# Altium schematic sheet T-FC10W-M.SchDoc
size A4; PageSetup: Record=PageOptions|CenterHorizontal=True|CenterVertical=True|PrintScale=0.97|XCorrection=1.00|YCorrection=1.00|PrintKind=0|BorderSize=5000000|LeftOffset=0|BottomOffset=0|Orientation=2|PaperLength=1000|PaperWidth=1000|Scale=100|PaperSource=7|PrintQuality=-3|MediaType=1|DitherType=10|PrintScaleMode=1|PaperKind=A4|PaperIndex=9
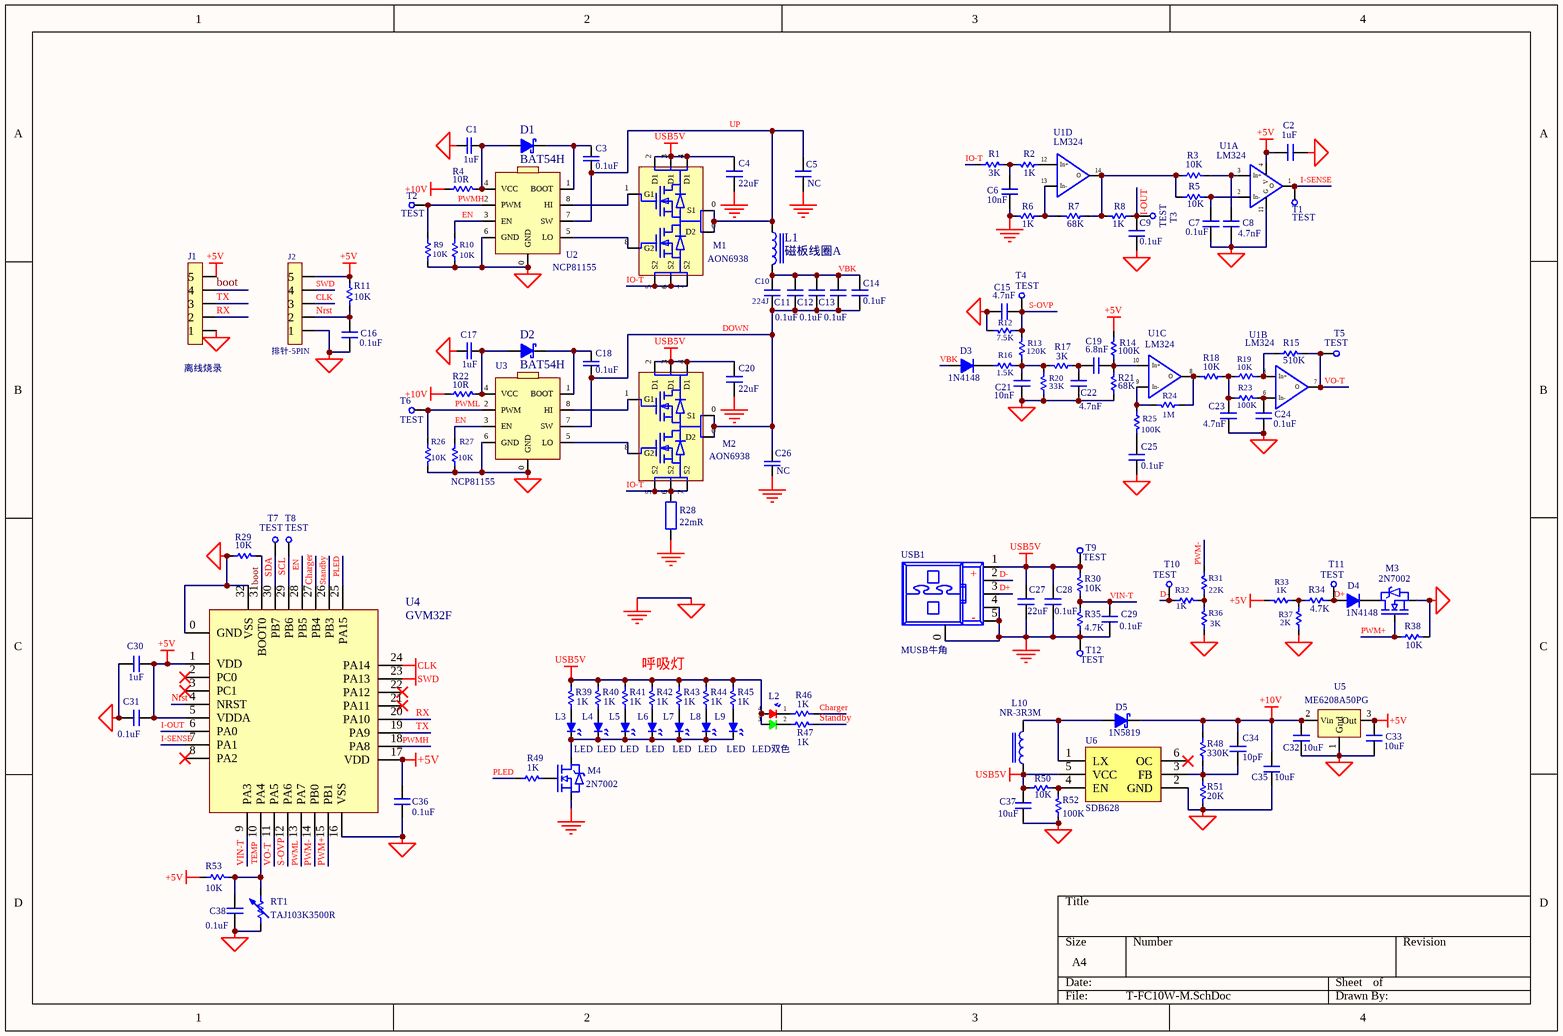
[diagram p0: T-FC10W-M.SchDoc]

## Parts
C1  0.1uF  [0603]  (value not drawn)
C2  1uF  [0603]
C3  0.1uF  [0603]
C4  22uF  [1206]
C5  NC  [0603]
C6  10nF  [0603]
C7  0.1uF  [0603]
C8  4.7nF  [0603]
C9  0.1uF  [0603]
C10  224J  [薄膜电容A]
C11  0.1uF  [1206]
C12  0.1uF  [1206]
C13  0.1uF  [1206]
C14  0.1uF  [1206]
C15  4.7nF  [0603]
C16  0.1uF  [0603]
C17  0.1uF  [0603]  (value not drawn)
C18  0.1uF  [0603]
C19  6.8nF  [0603]
C20  22uF  [1206]
C21  10nF  [0603]
C22  4.7nF  [0603]
C23  4.7nF  [0603]
C24  0.1uF  [0603]
C25  0.1uF  [0603]
C26  NC  [0603]
C27  22uF  [1206]
C28  0.1uF  [0603]
C29  0.1uF  [0603]
C30  1uF  [0603]
C31  0.1uF  [0603]
C32  10uF  [0805]
C33  10uF  [0805]
C34  10pF  [0603]
C35  10uF  [0805]
C36  0.1uF  [0603]
C37  10uF  [0805]
C38  0.1uF  [0603]
D1  BAT54H  [SOD-323]
D2  BAT54H  [SOD-323]
D3  1N4148  [SOD-323]
D4  1N4148  [SOD-323]
D5  1N5819  [SOD-123]
J1  离线烧录  [5PIN排针1.25mm]
J2  排针-5PIN  [5PIN排针1.25mm]
L1  磁板线圈A  [磁板线圈]
L2  LED双色  [LED0603双色]
L3  LED  [LED0802]
L4  LED  [LED0802]
L5  LED  [LED0802]
L6  LED  [LED0802]
L7  LED  [LED0802]
L8  LED  [LED0802]
L9  LED  [LED0802]
L10  NR-3R3M  [L3015T]
M1  AON6938  [QFN-5*6]
M2  AON6938  [QFN-5*6]
M3  2N7002  [SOT-23-L]
M4  2N7002  [SOT-23-L]
R1  3K  [0603]
R2  1K  [0603]
R3  10K  [0603]
R4  10R  [0603]
R5  10K  [0603]
R6  1K  [0603]
R7  68K  [0603]
R8  1K  [0603]
R9  10K  [0603]
R10  10K  [0603]
R11  10K  [0603]
R12  7.5K  [0603]
R13  120K  [0603]
R14  100K  [0603]
R15  510K  [0603]
R16  1.5K  [0603]
R17  3K  [0603]
R18  10K  [0603]
R19  10K  [0603]
R20  33K  [0603]
R21  68K  [0603]
R22  10R  [0603]
R23  100K  [0603]
R24  1M  [0603]
R25  100K  [0603]
R26  10K  [0603]
R27  10K  [0603]
R28  22mR  [1206]
R29  10K  [0603]
R30  10K  [0603]
R31  22K  [0603]
R32  1K  [0603]
R33  1K  [0603]
R34  4.7K  [0603]
R35  4.7K  [0603]
R36  3K  [0603]
R37  2K  [0603]
R38  10K  [0603]
R39  1K  [0603]
R40  1K  [0603]
R41  1K  [0603]
R42  1K  [0603]
R43  1K  [0603]
R44  1K  [0603]
R45  1K  [0603]
R46  1K  [0603]
R47  1K  [0603]
R48  330K  [0603]
R49  1K  [0603]
R50  10K  [0603]
R51  20K  [0603]
R52  100K  [0603]
R53  10K  [0603]
RT1  TAJ103K3500R  [0603]
T1  TEST  [测试点]
T2  TEST  [测试点]
T3  TEST  [测试点]
T4  TEST  [测试点]
T5  TEST  [测试点]
T6  TEST  [测试点]
T7  TEST  [测试点]
T8  TEST  [测试点]
T9  TEST  [测试点]
T10  TEST  [测试点]
T11  TEST  [测试点]
T12  TEST  [测试点]
U1  LM324  [SOP-14]  (parts A,B,C,D of 4)
U2  NCP81155  [QFN-3*3-1]
U3  NCP81155  [QFN-3*3-1]
U4  GVM32F  [QFN-32PIN]
U5  ME6208A50PG  [SOT-89]
U6  SDB628  [SOT-23-6]
USB1  MUSB牛角  [MICRO-USB牛角]

## Nets
+5V: C2.2 C30.1 C31.1 C33.2 C36.1 J1.5 J2.5 R11.1 R14.2 R33.2 R53.1 U1.4(V) U4.1(VDD) U4.5(VDDA) U4.17(VDD) U5.3(Out)
+10V: C32.2 C34.2 C35.2 D5.2(K) R4.1 R22.1 R48.2 U5.2(Vin)
CLK: J2.3 U4.24(PA14)
GND: C1.2 C2.1 C4.1 C5.1 C6.1 C7.1 C8.1 C9.2 C15.2 C16.1 C17.2 C20.1 C21.1 C22.1 C23.1 C24.1 C25.2 C26.1 C27.1 C28.1 C29.1 C30.2 C31.2 C32.1 C33.1 C35.1 C36.2 C37.1 C38.1 J1.1 J2.1 M3.3(S) M4.3(S) R6.2 R9.2 R10.1 R12.2 R20.1 R21.1 R26.2 R27.1 R28.1 R29.1 R35.1 R36.1 R37.1 R38.2 R51.2 R52.1 RT1.1 T12.1 U1.11(G) U2.0(GND) U2.6(GND) U3.0(GND) U3.6(GND) U4.0(GND) U4.16(VSS) U4.32(VSS) U5.1(Gnd) U6.2(GND) USB1.0 USB1.4 USB1.5
SWD: J2.4 U4.23(PA13)
USB5V: C4.2 C20.2 C27.2 C28.2 C37.2 L2.3(A) L2.4(A) L10.1 M1.2(D1) M1.3(D1) M1.4(D1) M2.2(D1) M2.3(D1) M2.4(D1) R30.2 R39.2 R40.2 R41.2 R42.2 R43.2 R44.2 R45.2 R50.1 T9.1 U6.5(VCC) USB1.1
boot: J1.4 R29.2 U4.31(BOOT0)
Charger: R46.2 U4.27(PB4)
D+: D4.1 R34.2 T11.1 USB1.3
D-: R32.1 T10.1 USB1.2
DOWN: C10.1 C11.1 C12.1 C13.1 C14.1 C18.1 C26.2 M2.0(D2) U3.7(SW)
EN: R10.2 R27.2 U2.3(EN) U3.3(EN) U4.28(PB5)
I-OUT: C9.1 R8.1 T3.1 U4.6(PA0)
I-SENSE: T1.1 U1.1(O) U4.7(PA1)
IO-T: M1.5(S2) M1.6(S2) M1.7(S2) M2.5(S2) M2.6(S2) M2.7(S2) R1.1 R28.2
Nrst: C16.2 J2.2 R11.2 U4.4(NRST)
PLED: R49.1 U4.25(PA15)
PWM+: M3.1(G) R38.1 U4.15(PB1)
PWM-: R31.2 U4.14(PB0)
PWMH: R9.1 T2.1 U2.2(PWM) U4.18(PA8)
PWML: R26.1 T6.1 U3.2(PWM) U4.13(PA7)
RX: J1.2 U4.20(PA10)
S-OVP: C15.1 R12.1 R13.2 T4.1 U4.12(PA6)
SCL: T8.1 U4.29(PB6)
SDA: T7.1 U4.30(PB7)
Standby: R47.2 U4.26(PB3)
TEMP: C38.2 R53.2 RT1.2 U4.10(PA4)
TX: J1.3 U4.19(PA9)
UP: C3.1 C5.2 L1.1 M1.0(D2) U2.7(SW)
VBK: C10.2 C11.2 C12.2 C13.2 C14.2 D3.1 L1.2
VIN-T: C29.2 R30.1 R35.2 U4.9(PA3)
VO-T: R15.2 T5.1 U1.7(O) U4.11(PA5)
NetC1_1: C1.1 D1.1(A) R4.2 U2.4(VCC)
NetC3_2: C3.2 D1.2(K) U2.1(BOOT)
NetC6_2: C6.2 R1.2 R2.2
NetC7_2: C7.2 R5.2 U1.2(In-)
NetC8_2: C8.2 R3.2 U1.3(In+)
NetC17_1: C17.1 D2.1(A) R22.2 U3.4(VCC)
NetC18_2: C18.2 D2.2(K) U3.1(BOOT)
NetC19_1: C19.1 C22.2 R17.1
NetC19_2: C19.2 R14.1 R21.2 U1.10(In+)
NetC21_2: C21.2 R13.1 R16.2 R17.2 R20.2
NetC23_2: C23.2 R18.1 R19.1 R23.1
NetC24_2: C24.2 R23.2 U1.6(In-)
NetC25_1: C25.1 R25.2
NetC34_1: C34.1 R48.1 R51.1 U6.3(FB)
NetD3_2: D3.2 R16.1
NetD4_2: D4.2 M3.2(D)
NetD5_1: D5.1(A) L10.2 U6.1(LX)
NetL2_1: L2.1(R) R46.1
NetL2_2: L2.2(G) R47.1
NetL3_1: L3.1(A) R39.1
NetL3_2: L3.2(K) L4.2(K) L5.2(K) L6.2(K) L7.2(K) L8.2(K) L9.2(K) M4.2(D)
NetL4_1: L4.1(A) R40.1
NetL5_1: L5.1(A) R41.1
NetL6_1: L6.1(A) R42.1
NetL7_1: L7.1(A) R43.1
NetL8_1: L8.1(A) R44.1
NetL9_1: L9.1(A) R45.1
NetM1_1: M1.1(G1) U2.8(HI)
NetM1_8: M1.8(G2) U2.5(LO)
NetM2_1: M2.1(G1) U3.8(HI)
NetM2_8: M2.8(G2) U3.5(LO)
NetM4_1: M4.1(G) R49.2
NetR2_1: R2.1 U1.12(In+)
NetR3_1: R3.1 R5.1 R7.1 R8.2 U1.14(O)
NetR6_1: R6.1 R7.2 U1.13(In-)
NetR15_1: R15.1 R19.2 U1.5(In+)
NetR18_2: R18.2 R24.1 U1.8(O)
NetR24_2: R24.2 R25.1 U1.9(In-)
NetR31_1: R31.1 R32.2 R36.2
NetR33_1: R33.1 R34.1 R37.2
NetR50_2: R50.2 R52.2 U6.4(EN)

Not connected (* = marked no-connect by the designer): U4 2(PC0)* 3(PC1)* 8(PA2)* 21(PA11)* 22(PA12)*; U6 6(OC)*

## Notes on the sheet
- 呼吸灯
- (in symbol C0603) 1uF
- (in symbol MICRO-USB-牛角) +; -

## Library data of the parts
C1-C3 C5-C9 C15-C19 C21-C26 C28-C31 C34 C36 C38 = C0603: 16V
C4 C20 C27 = C1206A: 16V
C10 = 薄膜电容B
C11-C14 = C1206: NPO
C32 C33 C35 C37 = C0805: 16V
D1 D2 = DIODE-SOD323
D3 D4 = DIODE-SOD323A
D5 = DIODE-SOD123
J1 = 排针-5PIN
L2 = LED0603双色
L3-L9 = LED0802: LED0802侧发光
L10 = L3015
M1 M2 = MOS-双N-DFN56: MOS双N
M3 M4 = MOS-N-SOT23A
R1 R4 R8-R11 R15 R17 R18 R22 R26 R27 R29 R32 R34 R38-R47 R49 R50 R52 R53 = R0603: 5%
R2 R3 R5-R7 R12-R14 R16 R19-R21 R23-R25 R30 R31 R33 R35-R37 R48 R51 = R0603A: 1%
R28 = R1206: 5%
RT1 = R0603-ADJ: 5%
T1-T12 = TEST-PIONT
U1 = IC-SOP-14
U2 U3 = IC-QFN33
U4 = IC-QFN32PA
U5 = LDO-SOT89
U6 = IC-SOT23-6
USB1 = MICRO-USB-牛角